# EAGLE design minsys_1 (EAGLE 6.4)
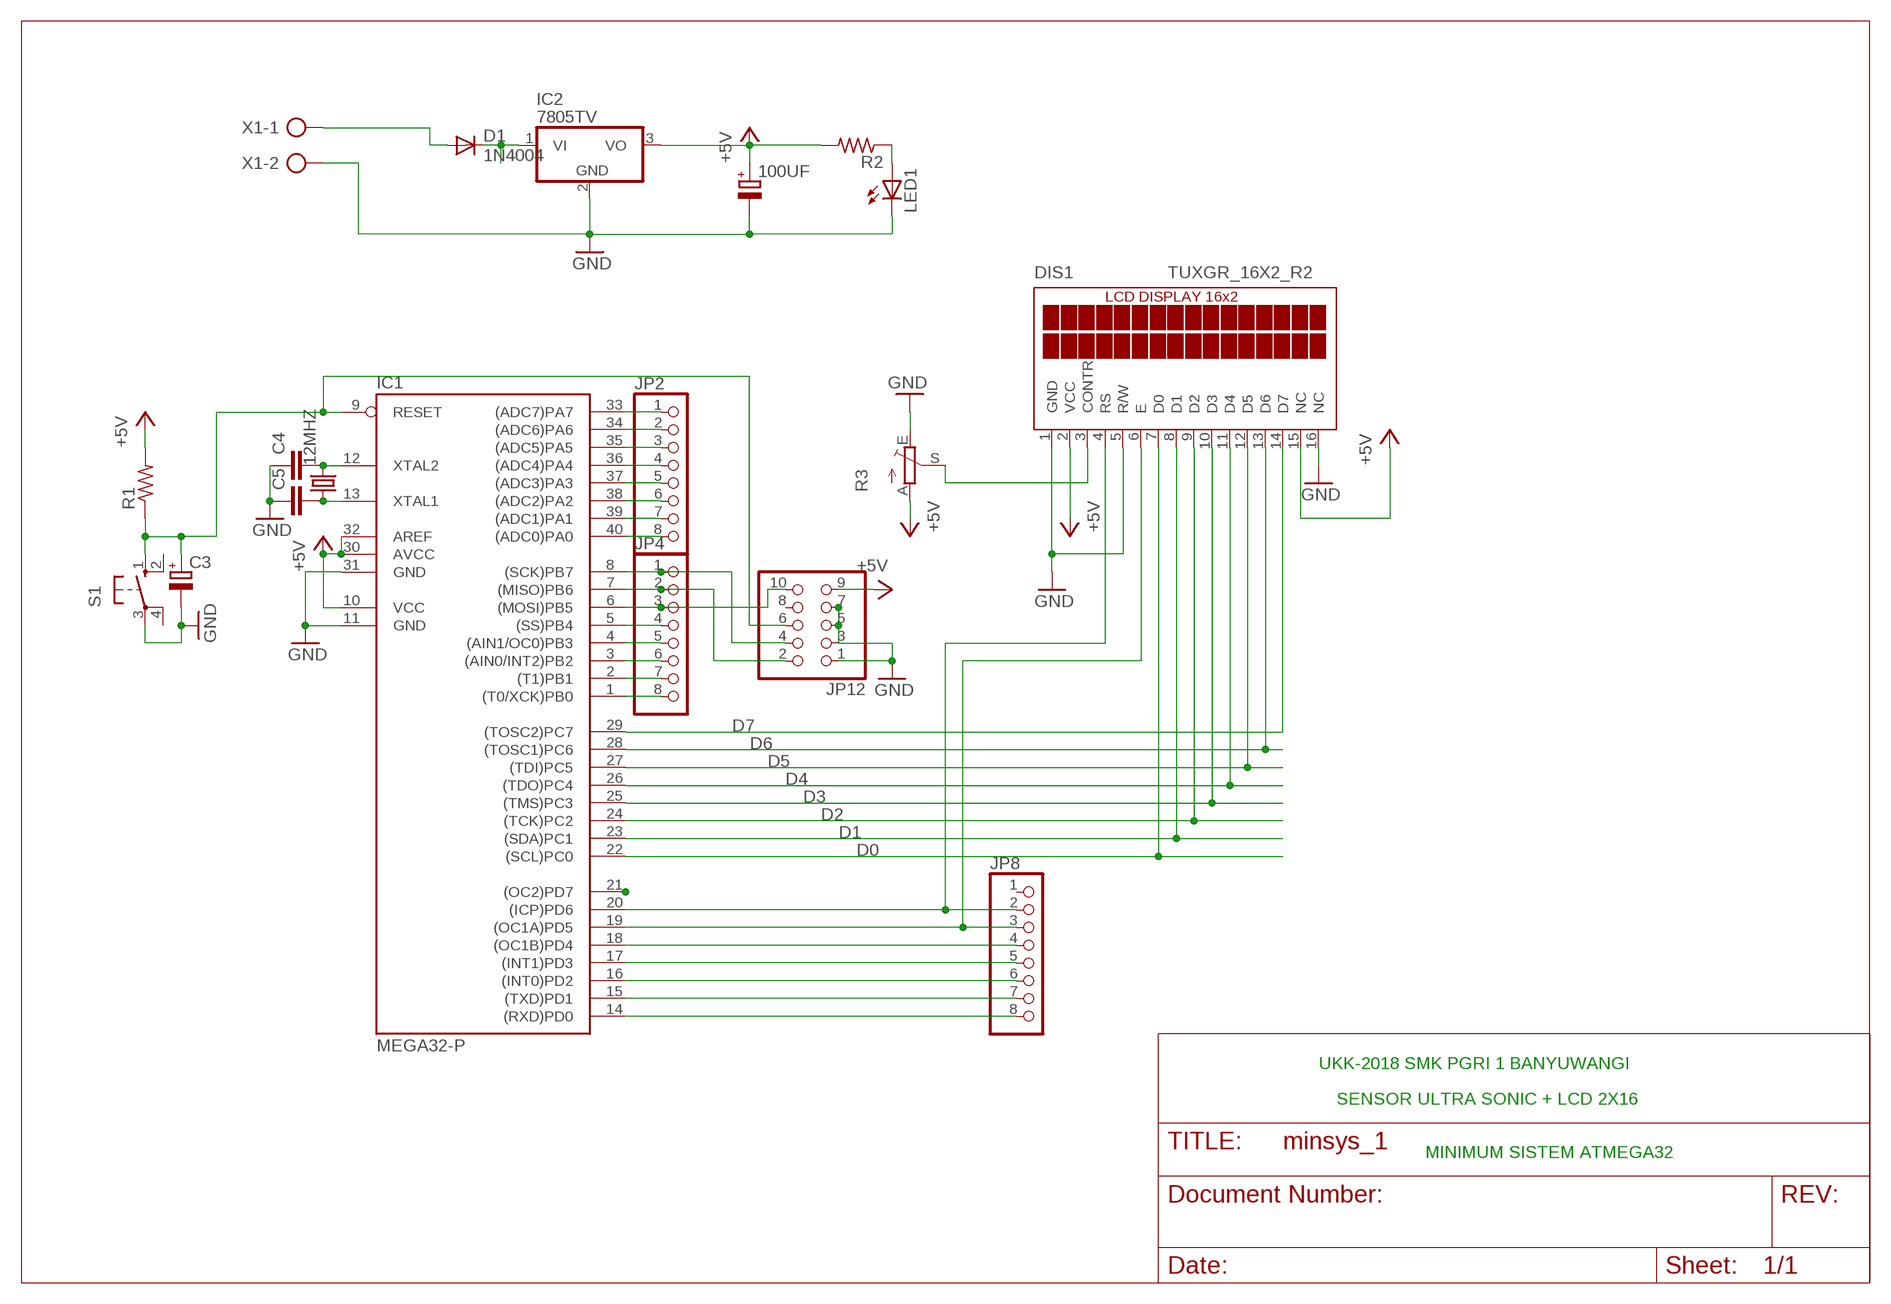
[diagram p0: schematic, sheet 1]

## Parts
12MHZ  CRYSTALHC49S  [HC49/S]
100UF  CPOL-EUE2.5-5  [E2,5-5]
C3  CPOL-EUE2-5  [E2-5]
C4  C-EU050-024X044  [C050-024X044]
C5  C-EU050-024X044  [C050-024X044]
D1  1N4004  [DO41-10]
DIS1  TUXGR_16X2_R2  [TUXGR_16X2_R2]
IC1  MEGA32-P  [DIL40]
IC2  7805TV  [TO220V]
JP2  PINHD-1X8  [1X08]
JP4  PINHD-1X8  [1X08]
JP8  PINHD-1X8  [1X08]
JP12  PINHD-2X5  [2X05]
LED1  LED3MM  [LED3MM]
R1  R-US_0207/10  [0207/10]
R2  R-US_0207/10  [0207/10]
R3  TRIM_EU-RS3  [RS3]
S1  10-XX  [B3F-10XX]
X1  AK300/2  [AK300/2]

## Nets
+5V: 100UF.+ DIS1.2(VCC) DIS1.15(NC) IC1.10(VCC) IC1.30(AVCC) IC1.32(AREF) IC2.3(VO) JP12.9 R1.2 R2.2 R3.A
D0: DIS1.7(D0) IC1.22((SCL)PC0)
D1: DIS1.8(D1) IC1.23((SDA)PC1)
D2: DIS1.9(D2) IC1.24((TCK)PC2)
D3: DIS1.10(D3) IC1.25((TMS)PC3)
D4: DIS1.11(D4) IC1.26((TDO)PC4)
D5: DIS1.12(D5) IC1.27((TDI)PC5)
D6: DIS1.13(D6) IC1.28((TOSC1)PC6)
D7: DIS1.14(D7) IC1.29((TOSC2)PC7)
GND: 100UF.- C3.- C4.1 C5.1 DIS1.1(GND) DIS1.5(R/W) DIS1.16(NC) IC1.11(GND) IC1.31(GND) IC2.2(GND) JP12.1 JP12.3 JP12.5 JP12.7 LED1.K(C) R3.E S1.3(P) X1.2
N$1: 12MHZ.2 C4.2 IC1.12(XTAL2)
N$2: 12MHZ.1 C5.2 IC1.13(XTAL1)
N$3: C3.+ IC1.9(RESET) JP12.6 R1.1 S1.1(S)
N$4: IC1.21((OC2)PD7)
N$6: IC1.33((ADC7)PA7) JP2.1
N$7: IC1.34((ADC6)PA6) JP2.2
N$8: IC1.35((ADC5)PA5) JP2.3
N$9: IC1.36((ADC4)PA4) JP2.4
N$10: IC1.37((ADC3)PA3) JP2.5
N$11: IC1.38((ADC2)PA2) JP2.6
N$12: IC1.39((ADC1)PA1) JP2.7
N$13: IC1.40((ADC0)PA0) JP2.8
N$15: IC1.7((MISO)PB6) JP4.2 JP12.2
N$16: IC1.6((MOSI)PB5) JP4.3 JP12.10
N$17: IC1.5((SS)PB4) JP4.4
N$18: IC1.4((AIN1/OC0)PB3) JP4.5
N$19: IC1.3((AIN0/INT2)PB2) JP4.6
N$20: IC1.2((T1)PB1) JP4.7
N$21: IC1.1((T0/XCK)PB0) JP4.8
N$26: DIS1.3(CONTR) R3.S
N$31: DIS1.4(RS) IC1.20((ICP)PD6) JP8.2
N$32: DIS1.6(E) IC1.19((OC1A)PD5) JP8.3
N$33: IC1.18((OC1B)PD4) JP8.4
N$34: IC1.17((INT1)PD3) JP8.5
N$35: IC1.16((INT0)PD2) JP8.6
N$36: IC1.15((TXD)PD1) JP8.7
N$37: IC1.14((RXD)PD0) JP8.8
N$41: D1.A X1.1
N$43: D1.C IC2.1(VI)
N$46: LED1.A R2.1
N$48: IC1.8((SCK)PB7) JP4.1 JP12.4
Unconnected: JP8.1 JP12.8 S1.2(S1) S1.4(P1)

## Notes on the sheet
- UKK-2018 SMK PGRI 1 BANYUWANGI
- SENSOR ULTRA SONIC + LCD 2X16
- MINIMUM SISTEM ATMEGA32

## Library data of the parts
12MHZ = crystal:CRYSTAL: CRYSTAL; OC_FARNELL: 1667008; OC_NEWARK: unknown
100UF C3 = resistor:CPOL-EU: POLARIZED CAPACITOR, European symbol
C4 C5 = resistor:C-EU: CAPACITOR, European symbol
D1 = diode:1N4004: DIODE general purpose rectifier, 1 A
DIS1 = display-lcd:TUXGR_16X2_R2: Tuxgraphics LCD display 16x2 characters reflective, without background light Source: tuxgr_12x2_r2.pdf; OC_FARNELL: unknown; OC_NEWARK: unknown
IC1 = atmel:MEGA32-P: MICROCONTROLLER 32 Kbytes FLASH 2 Kbytes SRAM 1 Kbytes EEPROM USART 8-channel 10 bit ADC Source: www.atmel.com .. doc2503.pdf; MPN: ATMEGA32-16PU; OC_FARNELL: 1661729; OC_NEWARK: 51P1794
IC2 = linear:78*: Positive VOLTAGE REGULATOR Source: http://cache.national.com/ds/LM/LM78L05.pdf http://www.fairchildsemi.com/ds/LM/LM7805.pdf
JP2 JP4 JP8 = pinhead:PINHD-1X8: PIN HEADER
JP12 = pinhead:PINHD-2X5: PIN HEADER
LED1 = led:LED: LED OSRAM: - CHIPLED LG R971, LG N971, LY N971, LG Q971, LY Q971, LO R971, LY R971 LH N974, LH R974 LS Q976, LO Q976, LY Q976 LO Q996 - Hyper CHIPLED LW Q18S LB Q993, LB Q99A, LB R99A - SideLED LS A670, LO A670, LY A670, LG A670, LP A670 LB A673, LV A673, LT A673, LW A673 LH A674 LY A675 LS A676, LA A676, LO A676, LY A676, LW A676 LS A679, LY A679, LG A679 - Hyper Micro SIDELED® LS Y876, LA Y876, LO Y876, LY Y876 LT Y87S - SmartLED LW L88C, LW L88S LB L89C, LB L89S, LG L890 LS L89K, LO L89K, LY L89K LS L896, LA L896, LO L896, LY L896 - TOPLED LS T670, LO T670, LY T670, LG T670, LP T670 LSG T670, LSP T670, LSY T670, LOP T670, LYG T670 LG T671, LOG T671, LSG T671 LB T673, LV T673, LT T673, LW T673 LH T674 LS T676, LA T676, LO T676, LY T676, LB T676, LH T676, LSB T676, LW T676 LB T67C, LV T67C, LT T67C, LS T67K, LO T67K, LY T67K, LW E67C LS E67B, LA E67B, LO E67B, LY E67B, LB E67C, LV E67C, LT E67C LW T67C LS T679, LY T679, LG T679 LS T770, LO T770, LY T770, LG T770, LP T770 LB T773, LV T773, LT T773, LW T773 LH T774 LS E675, LA E675, LY E675, LS T675 LS T776, LA T776, LO T776, LY T776, LB T776 LHGB T686 LT T68C, LB T68C - Hyper Mini TOPLED® LB M676 - Mini TOPLED Santana® LG M470 LS M47K, LO M47K, LY M47K Source: http://www.osram.convergy.de LUXEON: - LUMILED® LXK2-PW12-R00, LXK2-PW12-S00, LXK2-PW14-U00, LXK2-PW14-V00 LXK2-PM12-R00, LXK2-PM12-S00, LXK2-PM14-U00 LXK2-PE12-Q00, LXK2-PE12-R00, LXK2-PE12-S00, LXK2-PE14-T00, LXK2-PE14-U00 LXK2-PB12-K00, LXK2-PB12-L00, LXK2-PB12-M00, LXK2-PB14-N00, LXK2-PB14-P00, LXK2-PB14-Q00 LXK2-PR12-L00, LXK2-PR12-M00, LXK2-PR14-Q00, LXK2-PR14-R00 LXK2-PD12-Q00, LXK2-PD12-R00, LXK2-PD12-S00 LXK2-PH12-R00, LXK2-PH12-S00 LXK2-PL12-P00, LXK2-PL12-Q00, LXK2-PL12-R00 Source: www.luxeon.com KINGBRIGHT: KA-3528ASYC Source: www.kingbright.com
R1 R2 = resistor:R-US_: RESISTOR, American symbol
R3 = pot:TRIM_EU-: POTENTIOMETER
S1 = switch-omron:10-XX: OMRON SWITCH; MPN: B3F-1000; OC_FARNELL: 176432; OC_NEWARK: 36M3542
X1 = con-ptr500:AK300/2: CONNECTOR; OC_FARNELL: unknown; OC_NEWARK: unknown

## Board
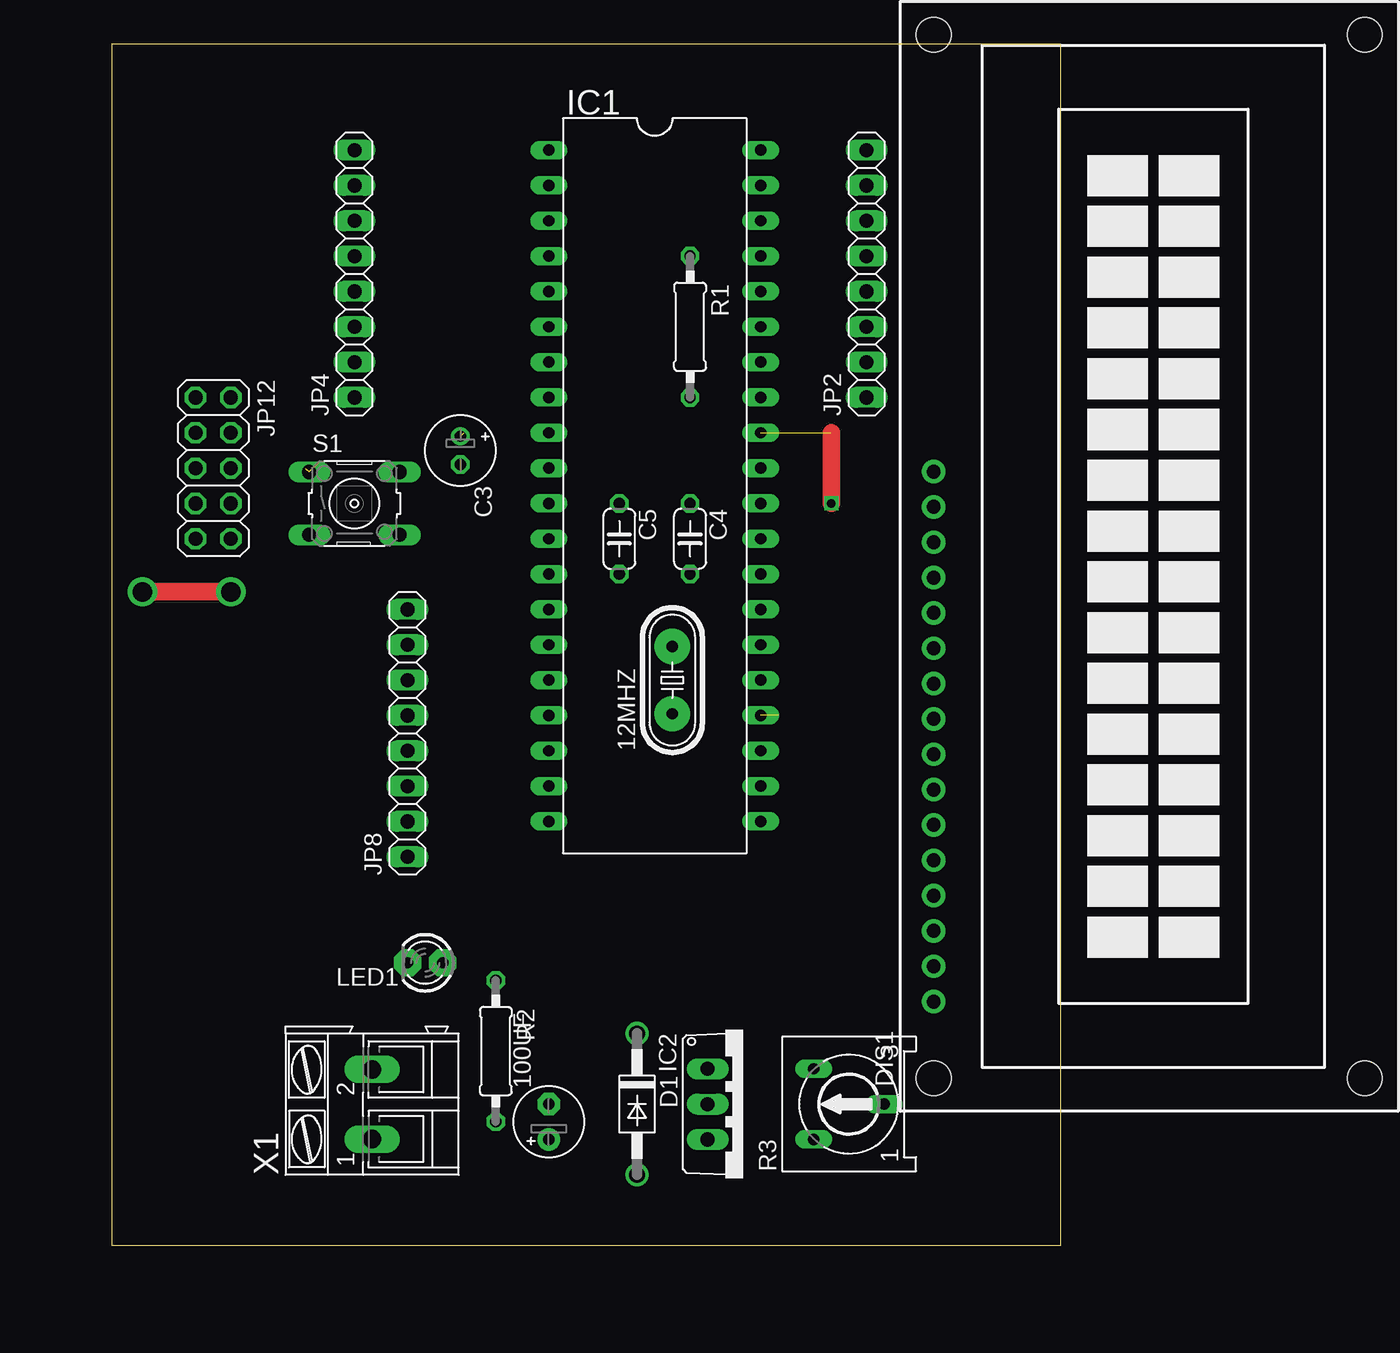
[diagram p1: board, top side]
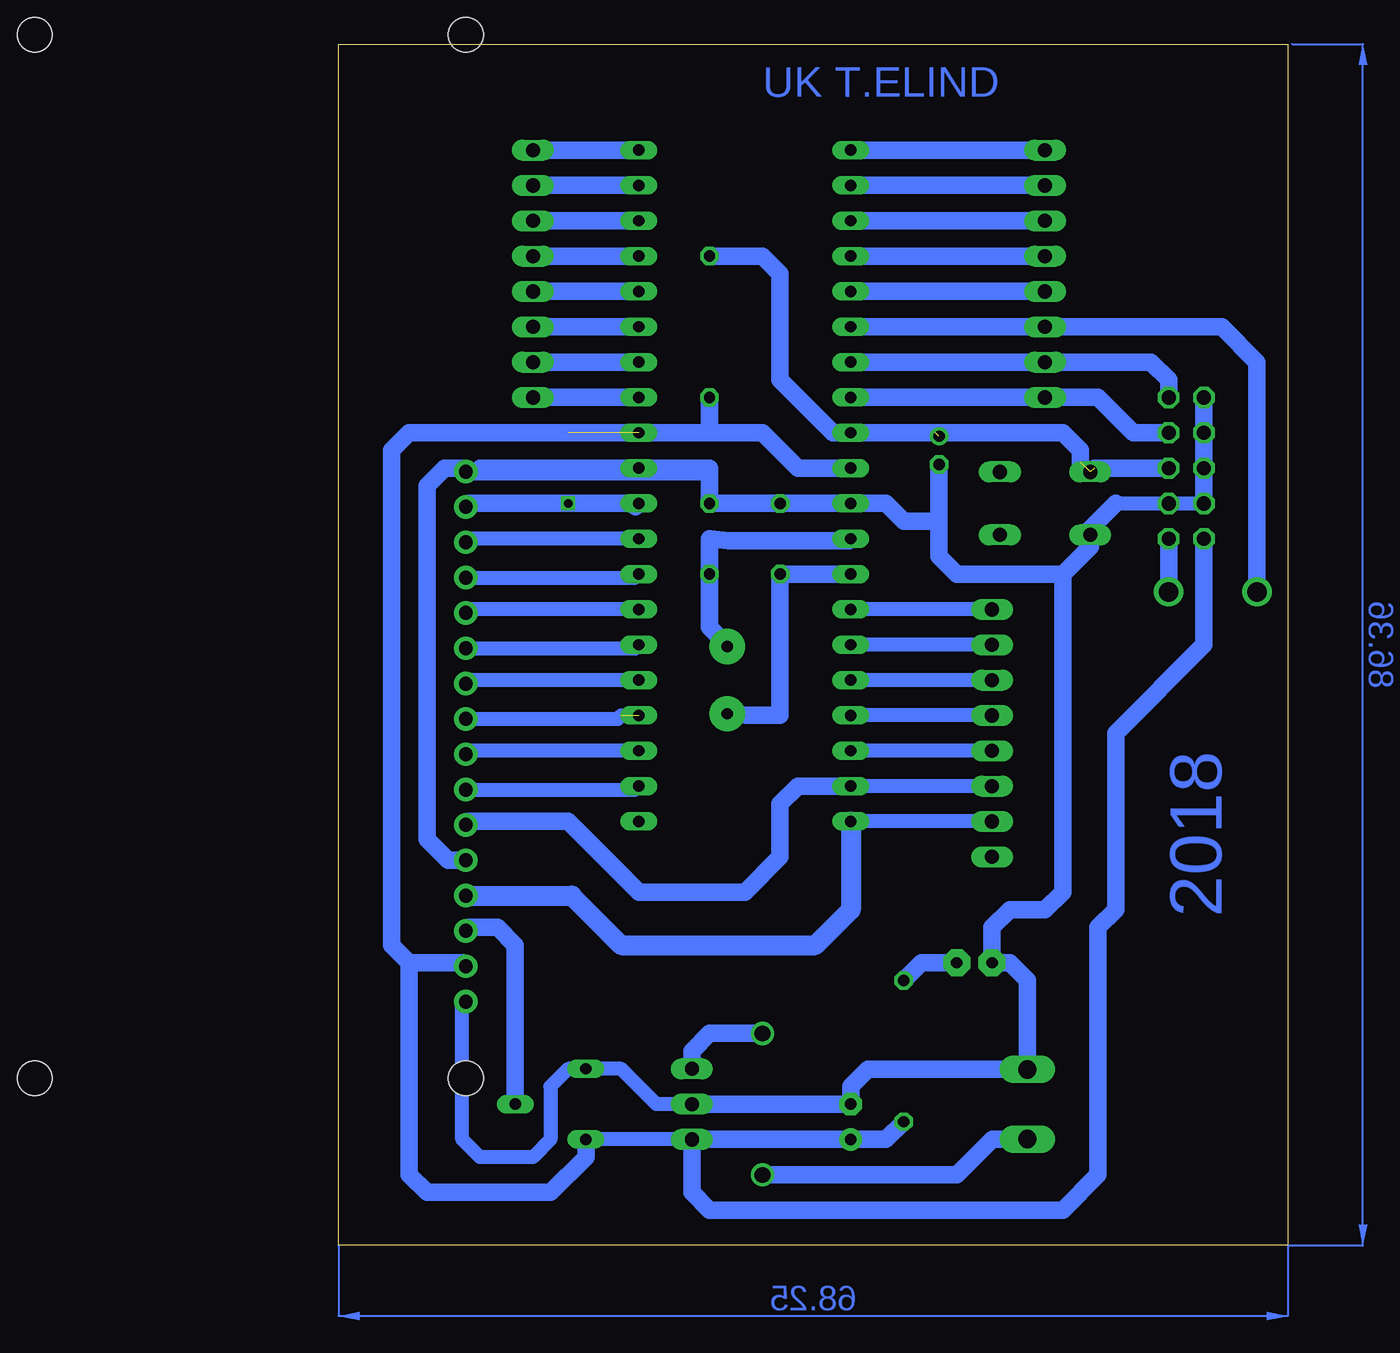
[diagram p2: board, bottom side, seen from below]

Size 68.25 x 86.34 mm. Coordinates in mm from the lower left corner, seen from the top.
Outline: 68.25,0 68.25,86.34 0,86.34 0,0 68.25,0
Copper layers (1*16): Top 0.035mm / dielectric 1.5mm / Bottom 0.035mm
Design rules "default *": minimum track width 10mil, minimum drill 24mil, track to track 8mil, track to pad 8mil, pad to pad 8mil, via to via 8mil, smd to smd 8mil, copper to edge 40mil, drill to drill 8mil, minimum pad ring 10mil, minimum via ring 8mil, stop-mask expansion 4mil, vias tented up to drill 0mil, thermal gap 10mil

### Footprints (pad centres in the part's own frame; a part is rotated, then mirrored left to right if it is on the bottom)
HC49/S = drill 0.813 pad 2.54: 1 -2.413,0; 2 2.413,0
E2,5-5 = drill 0.813 pad 1.6: + -1.27,0 | drill 0.813 pad 1.6 octagon: - 1.27,0
E2-5 = drill 0.813 pad 1.27: + -1.016,0 | drill 0.813 pad 1.27 octagon: - 1.016,0
C050-024X044 = drill 0.813 octagon: 1 -2.54,0; 2 2.54,0
DO41-10 = drill 1.118: A 5.08,0; C -5.08,0
TUXGR_16X2_R2 = drill 1 pad 1.676: 1 -32,15.5; 2 -29.46,15.5; 3 -26.92,15.5; 4 -24.38,15.5; 5 -21.84,15.5; 6 -19.3,15.5; 7 -16.76,15.5; 8 -14.22,15.5; 9 -11.68,15.5; 10 -9.14,15.5; 11 -6.6,15.5; 12 -4.06,15.5; 13 -1.52,15.5; 14 1.02,15.5; 15 3.56,15.5; 16 6.1,15.5 | hole 2.5: -37.5,-15.5; 37.5,-15.5; -37.5,15.5; 37.5,15.5
DIL40 = drill 0.813 long: 1 -24.13,-7.62; 2 -21.59,-7.62; 3 -19.05,-7.62; 4 -16.51,-7.62; 5 -13.97,-7.62; 6 -11.43,-7.62; 7 -8.89,-7.62; 8 -6.35,-7.62; 9 -3.81,-7.62; 10 -1.27,-7.62; 11 1.27,-7.62; 12 3.81,-7.62; 13 6.35,-7.62; 14 8.89,-7.62; 15 11.43,-7.62; 16 13.97,-7.62; 17 16.51,-7.62; 18 19.05,-7.62; 19 21.59,-7.62; 20 24.13,-7.62; 21 24.13,7.62; 22 21.59,7.62; 23 19.05,7.62; 24 16.51,7.62; 25 13.97,7.62; 26 11.43,7.62; 27 8.89,7.62; 28 6.35,7.62; 29 3.81,7.62; 30 1.27,7.62; 31 -1.27,7.62; 32 -3.81,7.62; 33 -6.35,7.62; 34 -8.89,7.62; 35 -11.43,7.62; 36 -13.97,7.62; 37 -16.51,7.62; 38 -19.05,7.62; 39 -21.59,7.62; 40 -24.13,7.62
TO220V = drill 1.016 long: 1 -2.54,-2.54; 2 0,-2.54; 3 2.54,-2.54
1X08 = drill 1.016 long: 1 -8.89,0; 2 -6.35,0; 3 -3.81,0; 4 -1.27,0; 5 1.27,0; 6 3.81,0; 7 6.35,0; 8 8.89,0
2X05 = drill 1.016 octagon: 1 -5.08,-1.27; 2 -5.08,1.27; 3 -2.54,-1.27; 4 -2.54,1.27; 5 0,-1.27; 6 0,1.27; 7 2.54,-1.27; 8 2.54,1.27; 9 5.08,-1.27; 10 5.08,1.27
LED3MM = drill 0.813 pad 1.93 octagon: A -1.27,0; K 1.27,0
0207/10 = drill 0.813 octagon: 1 -5.08,0; 2 5.08,0
RS3 = drill 0.813 long: A -2.54,2.54; E 2.54,2.54; S 0,-2.54
B3F-10XX = drill 1.016 long: 1 -3.251,2.261; 2 3.251,2.261; 3 -3.251,-2.261; 4 3.251,-2.261
AK300/2 = drill 1.321 long: 1 -2.515,0; 2 2.489,0

### Placement (x,y rotation side)
12MHZ  40.31,40.64 90 top
100UF  31.42,8.89 90 top
C3  25.07,57.15 270 top
C4  41.58,50.8 270 top
C5  36.5,50.8 270 top
D1  37.77,10.16 270 top
DIS1  74.6,49.53 90 top
IC1  39.04,54.61 270 top
IC2  45.39,10.16 270 top
JP2  54.28,69.85 90 top
JP4  17.45,69.85 90 top
JP8  21.26,36.83 90 top
JP12  7.29,55.88 270 top
LED1  22.53,20.32 180 top
R1  41.58,66.04 270 top
R2  27.61,13.97 270 top
R3  53.01,10.16 90 top
S1  17.45,53.34 0 top
X1  18.72,10.16 90 top

### Tracks (layer width: path | path; a pad name or v marks a point on that pad's centre or on a via)
+5V  (via drill 0.6)  (1 unrouted)
  Top 1.27: v51.74,53.34 51.74,58.42
  Bottom 1.016: JP12.9 6.02,46.99 | IC2.3 R3.A
  Bottom 1.27: R2.2 28.88,7.62 100UF.+ IC2.3 42.85,3.81 41.58,2.54 16.18,2.54 13.64,5.08 13.64,22.86 12.37,24.13 12.37,36.83 6.02,43.18 JP12.9 6.02,45.72 | IC1.10 35.23,55.88 37.77,58.42 41.58,58.42 | 41.58,58.42 IC1.32 63.17,58.42 64.44,57.15 64.44,21.59 63.17,20.32 | 46.91,53.09 IC1.30 v51.74,53.34 58.85,53.34 DIS1.15 | R1.2 41.58,58.42 | R3.A 50.47,6.35 53.01,3.81 61.9,3.81 63.17,5.08 63.17,20.32 | DIS1.2 59.35,20.32 63.17,20.32
D0
  Bottom 1.016: DIS1.7 46.91,32.77 IC1.22
D1
  Bottom 1.016: IC1.23 58.85,35.56 DIS1.8
D2  (1 unrouted)
  Bottom 1.016: DIS1.9 48.18,37.85 47.93,38.1
D3
  Bottom 1.016: IC1.25 58.85,40.64 DIS1.10
D4
  Bottom 1.016: DIS1.11 46.91,42.93 IC1.26
D5
  Bottom 1.016: IC1.27 58.85,45.72 DIS1.12
D6
  Bottom 1.016: DIS1.13 46.91,48.01 IC1.28
D7
  Bottom 1.016: IC1.29 58.85,50.8 DIS1.14
GND
  Bottom 1.016: 12.37,53.34 JP12.7 | IC2.2 45.39,10.16 47.93,12.7 R3.E 51.74,12.7 53.01,11.43 53.01,7.62 54.28,6.35 58.09,6.35 59.36,7.62 59.36,17.27 DIS1.1 | C4.1 28.88,53.34
  Bottom 1.27: JP12.1 JP12.3 JP12.5 JP12.7 | IC2.2 100UF.- 31.42,11.43 30.2,12.65 X1.2 18.72,19.05 19.99,20.32 LED1.K 21.26,22.86 19.99,24.13 17.45,24.13 16.18,25.4 16.18,48.26 | 12.37,53.34 14.2,51.51 S1.3 14.2,50.24 16.18,48.26 | DIS1.16 58.34,55.63 58.09,55.88 IC1.31 41.58,55.88 | C3.- 25.07,52.07 | 25.07,52.07 27.61,52.07 28.88,53.34 IC1.11 C5.1 C4.1 | 25.07,52.07 25.07,49.53 23.8,48.26 16.18,48.26 | DIS1.16 41.83,55.63 41.58,55.88 | 41.58,54.61 C4.1 | C4.1 41.58,55.88 | DIS1.5 60.38,27.69 61.9,29.21 61.9,54.61 60.63,55.88 59.35,55.88 DIS1.16
N$1
  Bottom 1.016: 31.55,50.67 IC1.12
  Bottom 1.27: 31.55,50.67 40.18,50.67 41.58,50.8 C4.2 41.58,44.45 40.31,43.18 12MHZ.2
N$2
  Bottom 1.27: IC1.13 C5.2 36.5,38.1 38.91,38.1 12MHZ.1
N$3  (3 unrouted)
  Bottom 1.27: JP12.6 13.92,55.88 | IC1.9 16.18,58.42 14.91,57.15 14.91,56.31 | IC1.9 25.32,58.42 | IC1.9 32.69,58.42 36.5,62.23 36.5,69.85 37.77,71.12 R1.1
N$6
  Bottom 1.27: IC1.33 JP2.1
N$7
  Bottom 1.27: JP2.2 IC1.34
N$8
  Bottom 1.27: IC1.35 JP2.3
N$9
  Bottom 1.27: JP2.4 IC1.36
N$10
  Bottom 1.27: IC1.37 JP2.5
N$11
  Bottom 1.27: JP2.6 IC1.38
N$12
  Bottom 1.27: IC1.39 JP2.7
N$13
  Bottom 1.27: JP2.8 IC1.40
N$15
  Bottom 1.27: IC1.7 JP4.2 9.83,63.5 8.56,62.23 JP12.2
N$16  (via drill 1.4 pad 0.3)
  Top 1.27: v2.21,46.99 v8.56,46.99
  Bottom 1.27: IC1.6 JP4.3 4.75,66.04 2.21,63.5 v2.21,46.99 | v8.56,46.99 JP12.10
N$17
  Bottom 1.27: IC1.5 JP4.4
N$18
  Bottom 1.27: IC1.4 JP4.5
N$19
  Bottom 1.27: IC1.3 JP4.6
N$20
  Bottom 1.27: JP4.7 IC1.2
N$21
  Bottom 1.27: JP4.8 IC1.1
N$26
  Bottom 1.27: R3.S 55.55,21.59 56.82,22.86 58.85,22.86 DIS1.3
N$31
  Bottom 1.016: JP8.2 IC1.20
  Bottom 1.422: IC1.20 31.42,24.13 33.96,21.59 47.93,21.59 51.49,25.15 DIS1.4
N$32
  Bottom 1.016: JP8.3 IC1.19
  Bottom 1.27: DIS1.6 58.85,30.48 51.74,30.48 46.66,25.4 39.04,25.4 36.5,27.94 36.5,31.75 35.23,33.02 IC1.19
N$33
  Bottom 1.016: JP8.4 IC1.18
N$34
  Bottom 1.016: JP8.5 IC1.17
N$35
  Bottom 1.016: JP8.6 IC1.16
N$36
  Bottom 1.016: JP8.7 IC1.15
N$37
  Bottom 1.016: JP8.8 IC1.14
N$41
  Bottom 1.27: X1.1 21.23,7.65 23.8,5.08 D1.A
N$43
  Bottom 1.27: D1.C 41.58,15.24 42.85,13.97 IC2.1
N$46
  Bottom 1.27: LED1.A 26.34,20.32 R2.1
N$48
  Bottom 1.27: IC1.8 JP4.1 13.64,60.96 11.1,58.42 JP12.4
(copper drawn outside any net)
  shapes: Bottom area x2

### Text on the board
Bottom: UK T.ELIND | 2018